# Altium schematic sheet BootFlash_SPI.SchDoc
size A4; DocumentNumber: 12; SheetNumber: 12; SheetTotal: 47
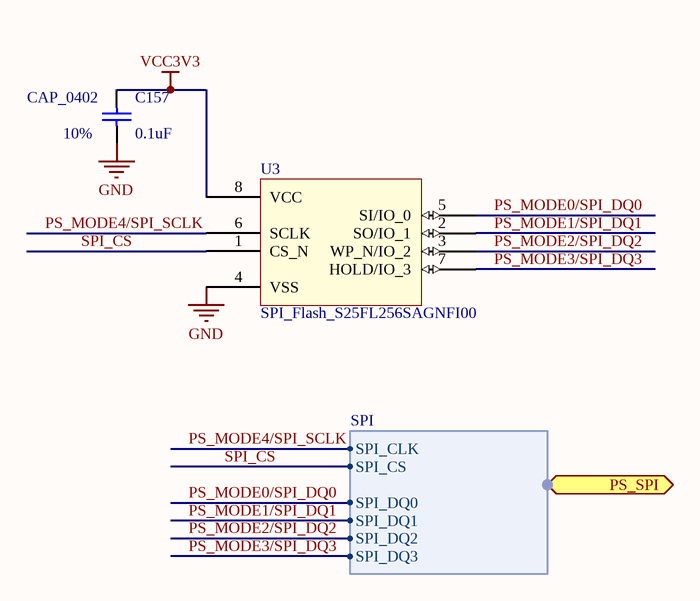
[diagram p0: BootFlash_SPI.SchDoc]

## Parts
C157  CAP_0402  value 0.1uF  Tolerance: 10%  [CAPC0402(1005)60_N]
U3  SPI_Flash_S25FL256SAGNFI00  [SPI_Flash_S25FL256SAGNFI00_WSON-8]

## Ports
PS_SPI (harness SPI)

## Harnesses
SPI: SPI_CLK, SPI_CS, SPI_DQ0, SPI_DQ1, SPI_DQ2, SPI_DQ3

## Nets
GND: C157.1 U3.4(VSS)
VCC3V3: C157.2 U3.8(VCC)
PS_MODE0/SPI_DQ0: U3.5(SI/IO_0) ; port PS_SPI.SPI_DQ0
PS_MODE1/SPI_DQ1: U3.2(SO/IO_1) ; port PS_SPI.SPI_DQ1
PS_MODE2/SPI_DQ2: U3.3(WP_N/IO_2) ; port PS_SPI.SPI_DQ2
PS_MODE3/SPI_DQ3: U3.7(HOLD/IO_3) ; port PS_SPI.SPI_DQ3
PS_MODE4/SPI_SCLK: U3.6(SCLK) ; port PS_SPI.SPI_CLK
SPI_CS: U3.1(CS_N) ; port PS_SPI.SPI_CS

## Library data of the parts
C157 = C1005X5R0J104K: 0.1uf, ceramic, 10%, 6.3V, X5R, 0402; Manufacturer: TDK Corporation; Part Number: C1005X5R0J104K; Footprint Ref: CAPC0402(1005)60_N; Library Ref: CAP_0402
U3 = S25FL256SAGNFI001: S25FL256SAGMFI00, Serial Flash Memory, 256Mbit, Low Voltage, 104MHz SPI Bus Interface, SOIC16 WIDE; Manufacturer: Spansion; Part Number: S25FL256SAGNFI001